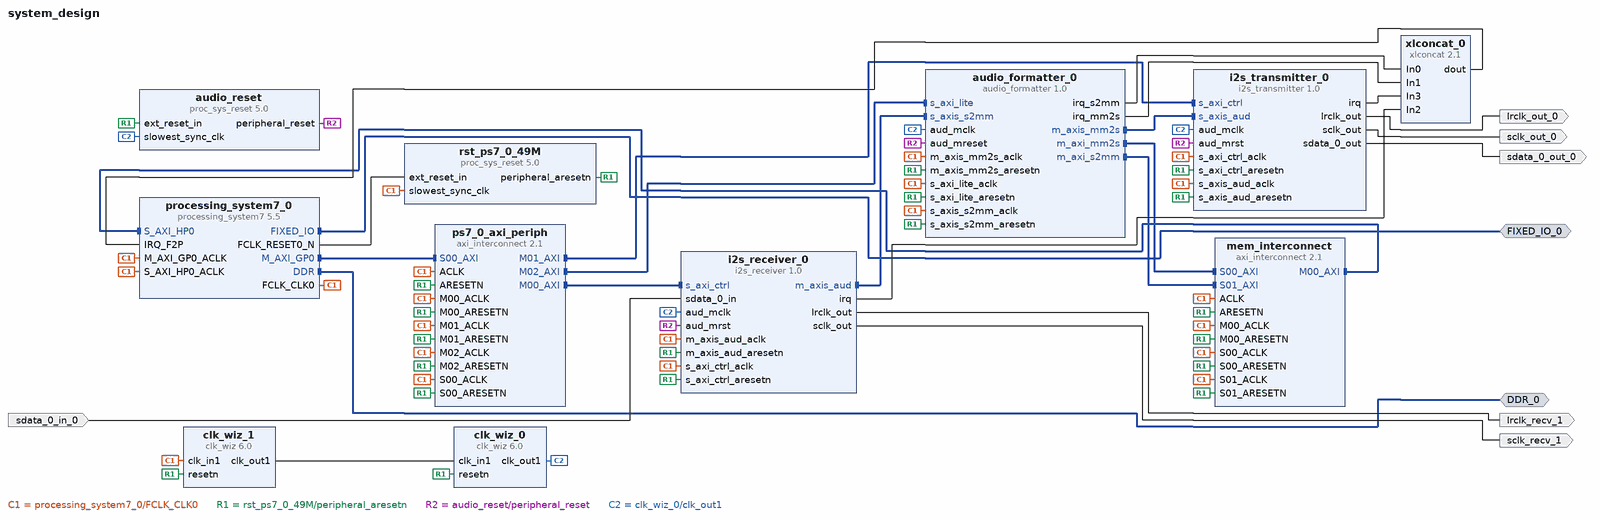
[diagram p0: block diagram of the top level]
# Vivado block design system_design, xc7z010clg400-1, Vivado 2019.1
create_bd_design system_design

create_bd_intf_port -mode Master -vlnv xilinx.com:interface:ddrx_rtl:1.0 DDR_0
create_bd_intf_port -mode Master -vlnv xilinx.com:display_processing_system7:fixedio_rtl:1.0 FIXED_IO_0
create_bd_port -dir O lrclk_out_0
create_bd_port -dir O sclk_out_0
create_bd_port -dir O sdata_0_out_0
create_bd_port -dir I sdata_0_in_0
create_bd_port -dir O lrclk_recv_1
create_bd_port -dir O sclk_recv_1

create_bd_cell -type ip -vlnv xilinx.com:ip:processing_system7:5.5 processing_system7_0
set_property -dict [list \
  CONFIG.PCW_ENET0_ENET0_IO {MIO 16 .. 27} \
  CONFIG.PCW_ENET0_GRP_MDIO_ENABLE 1 \
  CONFIG.PCW_ENET0_GRP_MDIO_IO {MIO 52 .. 53} \
  CONFIG.PCW_ENET0_PERIPHERAL_ENABLE 1 \
  CONFIG.PCW_FCLK0_PERIPHERAL_CLKSRC {ARM PLL} \
  CONFIG.PCW_FPGA0_PERIPHERAL_FREQMHZ 50 \
  CONFIG.PCW_I2C1_I2C1_IO {MIO 28 .. 29} \
  CONFIG.PCW_I2C1_PERIPHERAL_ENABLE 1 \
  CONFIG.PCW_I2C_PERIPHERAL_FREQMHZ 111.111115 \
  CONFIG.PCW_IRQ_F2P_INTR 1 \
  CONFIG.PCW_NAND_NAND_IO {MIO 0 2.. 14} \
  CONFIG.PCW_NAND_PERIPHERAL_ENABLE 1 \
  CONFIG.PCW_PRESET_BANK1_VOLTAGE {LVCMOS 2.5V} \
  CONFIG.PCW_SD0_GRP_CD_ENABLE 0 \
  CONFIG.PCW_SD0_GRP_WP_ENABLE 0 \
  CONFIG.PCW_SD0_PERIPHERAL_ENABLE 1 \
  CONFIG.PCW_SD0_SD0_IO {MIO 40 .. 45} \
  CONFIG.PCW_SDIO_PERIPHERAL_FREQMHZ 100 \
  CONFIG.PCW_UART1_PERIPHERAL_ENABLE 1 \
  CONFIG.PCW_UART1_UART1_IO {MIO 48 .. 49} \
  CONFIG.PCW_UART_PERIPHERAL_FREQMHZ 100 \
  CONFIG.PCW_UIPARAM_DDR_PARTNO {MT41K256M16 RE-125} \
  CONFIG.PCW_USE_FABRIC_INTERRUPT 1 \
  CONFIG.PCW_USE_S_AXI_HP0 1 \
] [get_bd_cells processing_system7_0]
# 168 more settings of processing_system7_0 are not shown: defaults, MIO pin electricals, DDR timing, and values the tool derives
create_bd_cell -type ip -vlnv xilinx.com:ip:i2s_receiver:1.0 i2s_receiver_0
set_property -dict {CONFIG.C_DEPTH 512 CONFIG.C_DWIDTH 16 CONFIG.C_IS_MASTER 1} [get_bd_cells i2s_receiver_0]
create_bd_cell -type ip -vlnv xilinx.com:ip:i2s_transmitter:1.0 i2s_transmitter_0
set_property -dict {CONFIG.C_DEPTH 512 CONFIG.C_DWIDTH 16} [get_bd_cells i2s_transmitter_0]
create_bd_cell -type ip -vlnv xilinx.com:ip:audio_formatter:1.0 audio_formatter_0
set_property -dict [list \
  CONFIG.C_MM2S_ADDR_WIDTH 32 \
  CONFIG.C_MM2S_ASYNC_CLOCK 0 \
  CONFIG.C_MM2S_DATAFORMAT 3 \
  CONFIG.C_S2MM_ADDR_WIDTH 32 \
  CONFIG.C_S2MM_ASYNC_CLOCK 0 \
  CONFIG.C_S2MM_DATAFORMAT 1 \
] [get_bd_cells audio_formatter_0]
create_bd_cell -type ip -vlnv xilinx.com:ip:axi_interconnect:2.1 ps7_0_axi_periph
set_property -dict {CONFIG.NUM_MI 3} [get_bd_cells ps7_0_axi_periph]
create_bd_cell -type ip -vlnv xilinx.com:ip:proc_sys_reset:5.0 rst_ps7_0_49M
create_bd_cell -type ip -vlnv xilinx.com:ip:proc_sys_reset:5.0 audio_reset
create_bd_cell -type ip -vlnv xilinx.com:ip:clk_wiz:6.0 clk_wiz_1
set_property -dict [list \
  CONFIG.CLKOUT1_JITTER 332.358 \
  CONFIG.CLKOUT1_PHASE_ERROR 393.382 \
  CONFIG.CLKOUT1_REQUESTED_OUT_FREQ 100 \
  CONFIG.MMCM_CLKFBOUT_MULT_F 50.125 \
  CONFIG.MMCM_CLKOUT0_DIVIDE_F 8.250 \
  CONFIG.MMCM_DIVCLK_DIVIDE 3 \
  CONFIG.PRIM_SOURCE Single_ended_clock_capable_pin \
  CONFIG.RESET_PORT resetn \
  CONFIG.RESET_TYPE ACTIVE_LOW \
  CONFIG.USE_LOCKED false \
] [get_bd_cells clk_wiz_1]
create_bd_cell -type ip -vlnv xilinx.com:ip:axi_interconnect:2.1 mem_interconnect
set_property -dict {CONFIG.NUM_MI 1 CONFIG.NUM_SI 2} [get_bd_cells mem_interconnect]
create_bd_cell -type ip -vlnv xilinx.com:ip:xlconcat:2.1 xlconcat_0
set_property -dict {CONFIG.NUM_PORTS 4} [get_bd_cells xlconcat_0]
create_bd_cell -type ip -vlnv xilinx.com:ip:clk_wiz:6.0 clk_wiz_0
set_property -dict [list \
  CONFIG.CLKOUT1_JITTER 275.002 \
  CONFIG.CLKOUT1_PHASE_ERROR 301.099 \
  CONFIG.CLKOUT1_REQUESTED_OUT_FREQ 18.432 \
  CONFIG.MMCM_CLKFBOUT_MULT_F 57.250 \
  CONFIG.MMCM_CLKOUT0_DIVIDE_F 62.125 \
  CONFIG.MMCM_DIVCLK_DIVIDE 5 \
  CONFIG.RESET_PORT resetn \
  CONFIG.RESET_TYPE ACTIVE_LOW \
  CONFIG.USE_LOCKED false \
] [get_bd_cells clk_wiz_0]

# ---- connections ----

connect_bd_intf_net [get_bd_intf_pins audio_formatter_0/s_axis_s2mm] [get_bd_intf_pins i2s_receiver_0/m_axis_aud]
connect_bd_intf_net [get_bd_intf_pins mem_interconnect/M00_AXI] [get_bd_intf_pins processing_system7_0/S_AXI_HP0]
connect_bd_intf_net [get_bd_intf_pins processing_system7_0/M_AXI_GP0] [get_bd_intf_pins ps7_0_axi_periph/S00_AXI]
connect_bd_intf_net [get_bd_intf_pins ps7_0_axi_periph/M02_AXI] [get_bd_intf_pins audio_formatter_0/s_axi_lite]
connect_bd_intf_net [get_bd_intf_pins audio_formatter_0/m_axi_mm2s] [get_bd_intf_pins mem_interconnect/S00_AXI]
connect_bd_intf_net [get_bd_intf_ports FIXED_IO_0] [get_bd_intf_pins processing_system7_0/FIXED_IO]
connect_bd_intf_net [get_bd_intf_ports DDR_0] [get_bd_intf_pins processing_system7_0/DDR]
connect_bd_intf_net [get_bd_intf_pins ps7_0_axi_periph/M00_AXI] [get_bd_intf_pins i2s_receiver_0/s_axi_ctrl]
connect_bd_intf_net [get_bd_intf_pins audio_formatter_0/m_axis_mm2s] [get_bd_intf_pins i2s_transmitter_0/s_axis_aud]
connect_bd_intf_net [get_bd_intf_pins audio_formatter_0/m_axi_s2mm] [get_bd_intf_pins mem_interconnect/S01_AXI]
connect_bd_intf_net [get_bd_intf_pins ps7_0_axi_periph/M01_AXI] [get_bd_intf_pins i2s_transmitter_0/s_axi_ctrl]
connect_bd_net [get_bd_pins processing_system7_0/FCLK_CLK0] \
  [get_bd_pins processing_system7_0/M_AXI_GP0_ACLK] [get_bd_pins ps7_0_axi_periph/S00_ACLK] \
  [get_bd_pins rst_ps7_0_49M/slowest_sync_clk] [get_bd_pins i2s_receiver_0/s_axi_ctrl_aclk] \
  [get_bd_pins ps7_0_axi_periph/M00_ACLK] [get_bd_pins ps7_0_axi_periph/ACLK] [get_bd_pins i2s_transmitter_0/s_axi_ctrl_aclk] \
  [get_bd_pins ps7_0_axi_periph/M01_ACLK] [get_bd_pins audio_formatter_0/s_axi_lite_aclk] \
  [get_bd_pins ps7_0_axi_periph/M02_ACLK] [get_bd_pins audio_formatter_0/m_axis_mm2s_aclk] \
  [get_bd_pins mem_interconnect/S00_ACLK] [get_bd_pins processing_system7_0/S_AXI_HP0_ACLK] \
  [get_bd_pins mem_interconnect/M00_ACLK] [get_bd_pins mem_interconnect/ACLK] \
  [get_bd_pins audio_formatter_0/s_axis_s2mm_aclk] [get_bd_pins mem_interconnect/S01_ACLK] \
  [get_bd_pins i2s_transmitter_0/s_axis_aud_aclk] [get_bd_pins i2s_receiver_0/m_axis_aud_aclk] \
  [get_bd_pins clk_wiz_1/clk_in1]
connect_bd_net [get_bd_pins processing_system7_0/FCLK_RESET0_N] [get_bd_pins rst_ps7_0_49M/ext_reset_in]
connect_bd_net [get_bd_pins rst_ps7_0_49M/peripheral_aresetn] \
  [get_bd_pins ps7_0_axi_periph/S00_ARESETN] [get_bd_pins i2s_receiver_0/s_axi_ctrl_aresetn] \
  [get_bd_pins ps7_0_axi_periph/M00_ARESETN] [get_bd_pins ps7_0_axi_periph/ARESETN] \
  [get_bd_pins i2s_transmitter_0/s_axi_ctrl_aresetn] [get_bd_pins ps7_0_axi_periph/M01_ARESETN] \
  [get_bd_pins audio_formatter_0/s_axi_lite_aresetn] [get_bd_pins ps7_0_axi_periph/M02_ARESETN] \
  [get_bd_pins clk_wiz_1/resetn] [get_bd_pins audio_reset/ext_reset_in] [get_bd_pins i2s_transmitter_0/s_axis_aud_aresetn] \
  [get_bd_pins i2s_receiver_0/m_axis_aud_aresetn] [get_bd_pins audio_formatter_0/m_axis_mm2s_aresetn] \
  [get_bd_pins mem_interconnect/S00_ARESETN] [get_bd_pins mem_interconnect/M00_ARESETN] \
  [get_bd_pins mem_interconnect/ARESETN] [get_bd_pins audio_formatter_0/s_axis_s2mm_aresetn] \
  [get_bd_pins mem_interconnect/S01_ARESETN] [get_bd_pins clk_wiz_0/resetn]
connect_bd_net [get_bd_pins audio_formatter_0/irq_s2mm] [get_bd_pins xlconcat_0/In0]
connect_bd_net [get_bd_pins audio_formatter_0/irq_mm2s] [get_bd_pins xlconcat_0/In1]
connect_bd_net [get_bd_pins i2s_receiver_0/irq] [get_bd_pins xlconcat_0/In2]
connect_bd_net [get_bd_pins i2s_transmitter_0/irq] [get_bd_pins xlconcat_0/In3]
connect_bd_net [get_bd_pins xlconcat_0/dout] [get_bd_pins processing_system7_0/IRQ_F2P]
connect_bd_net [get_bd_pins i2s_transmitter_0/sdata_0_out] [get_bd_ports sdata_0_out_0]
connect_bd_net -net sdata_0_in_0_1 [get_bd_ports sdata_0_in_0] [get_bd_pins i2s_receiver_0/sdata_0_in]
connect_bd_net [get_bd_pins audio_reset/peripheral_reset] \
  [get_bd_pins i2s_transmitter_0/aud_mrst] [get_bd_pins i2s_receiver_0/aud_mrst] [get_bd_pins audio_formatter_0/aud_mreset]
connect_bd_net [get_bd_pins i2s_transmitter_0/sclk_out] [get_bd_ports sclk_out_0]
connect_bd_net [get_bd_pins i2s_transmitter_0/lrclk_out] [get_bd_ports lrclk_out_0]
connect_bd_net [get_bd_pins clk_wiz_1/clk_out1] [get_bd_pins clk_wiz_0/clk_in1]
connect_bd_net [get_bd_pins clk_wiz_0/clk_out1] \
  [get_bd_pins audio_reset/slowest_sync_clk] [get_bd_pins audio_formatter_0/aud_mclk] [get_bd_pins i2s_receiver_0/aud_mclk] \
  [get_bd_pins i2s_transmitter_0/aud_mclk]
connect_bd_net [get_bd_pins i2s_receiver_0/lrclk_out] [get_bd_ports lrclk_recv_1]
connect_bd_net [get_bd_pins i2s_receiver_0/sclk_out] [get_bd_ports sclk_recv_1]

# ---- address map ----
assign_bd_address -offset 0x00000000 -range 1G -target_address_space [get_bd_addr_spaces audio_formatter_0/m_axi_mm2s] [get_bd_addr_segs processing_system7_0/S_AXI_HP0/HP0_DDR_LOWOCM]
assign_bd_address -offset 0x00000000 -range 1G -target_address_space [get_bd_addr_spaces audio_formatter_0/m_axi_s2mm] [get_bd_addr_segs processing_system7_0/S_AXI_HP0/HP0_DDR_LOWOCM]
assign_bd_address -offset 0x43C00000 -range 64K -target_address_space [get_bd_addr_spaces processing_system7_0/Data] [get_bd_addr_segs i2s_receiver_0/s_axi_ctrl/Reg]
assign_bd_address -offset 0x43C10000 -range 64K -target_address_space [get_bd_addr_spaces processing_system7_0/Data] [get_bd_addr_segs i2s_transmitter_0/s_axi_ctrl/Reg]
assign_bd_address -offset 0x43C20000 -range 64K -target_address_space [get_bd_addr_spaces processing_system7_0/Data] [get_bd_addr_segs audio_formatter_0/s_axi_lite/reg0]

validate_bd_design
save_bd_design
